# EAGLE schematic bt-shield-schmitt (EAGLE 6.1)
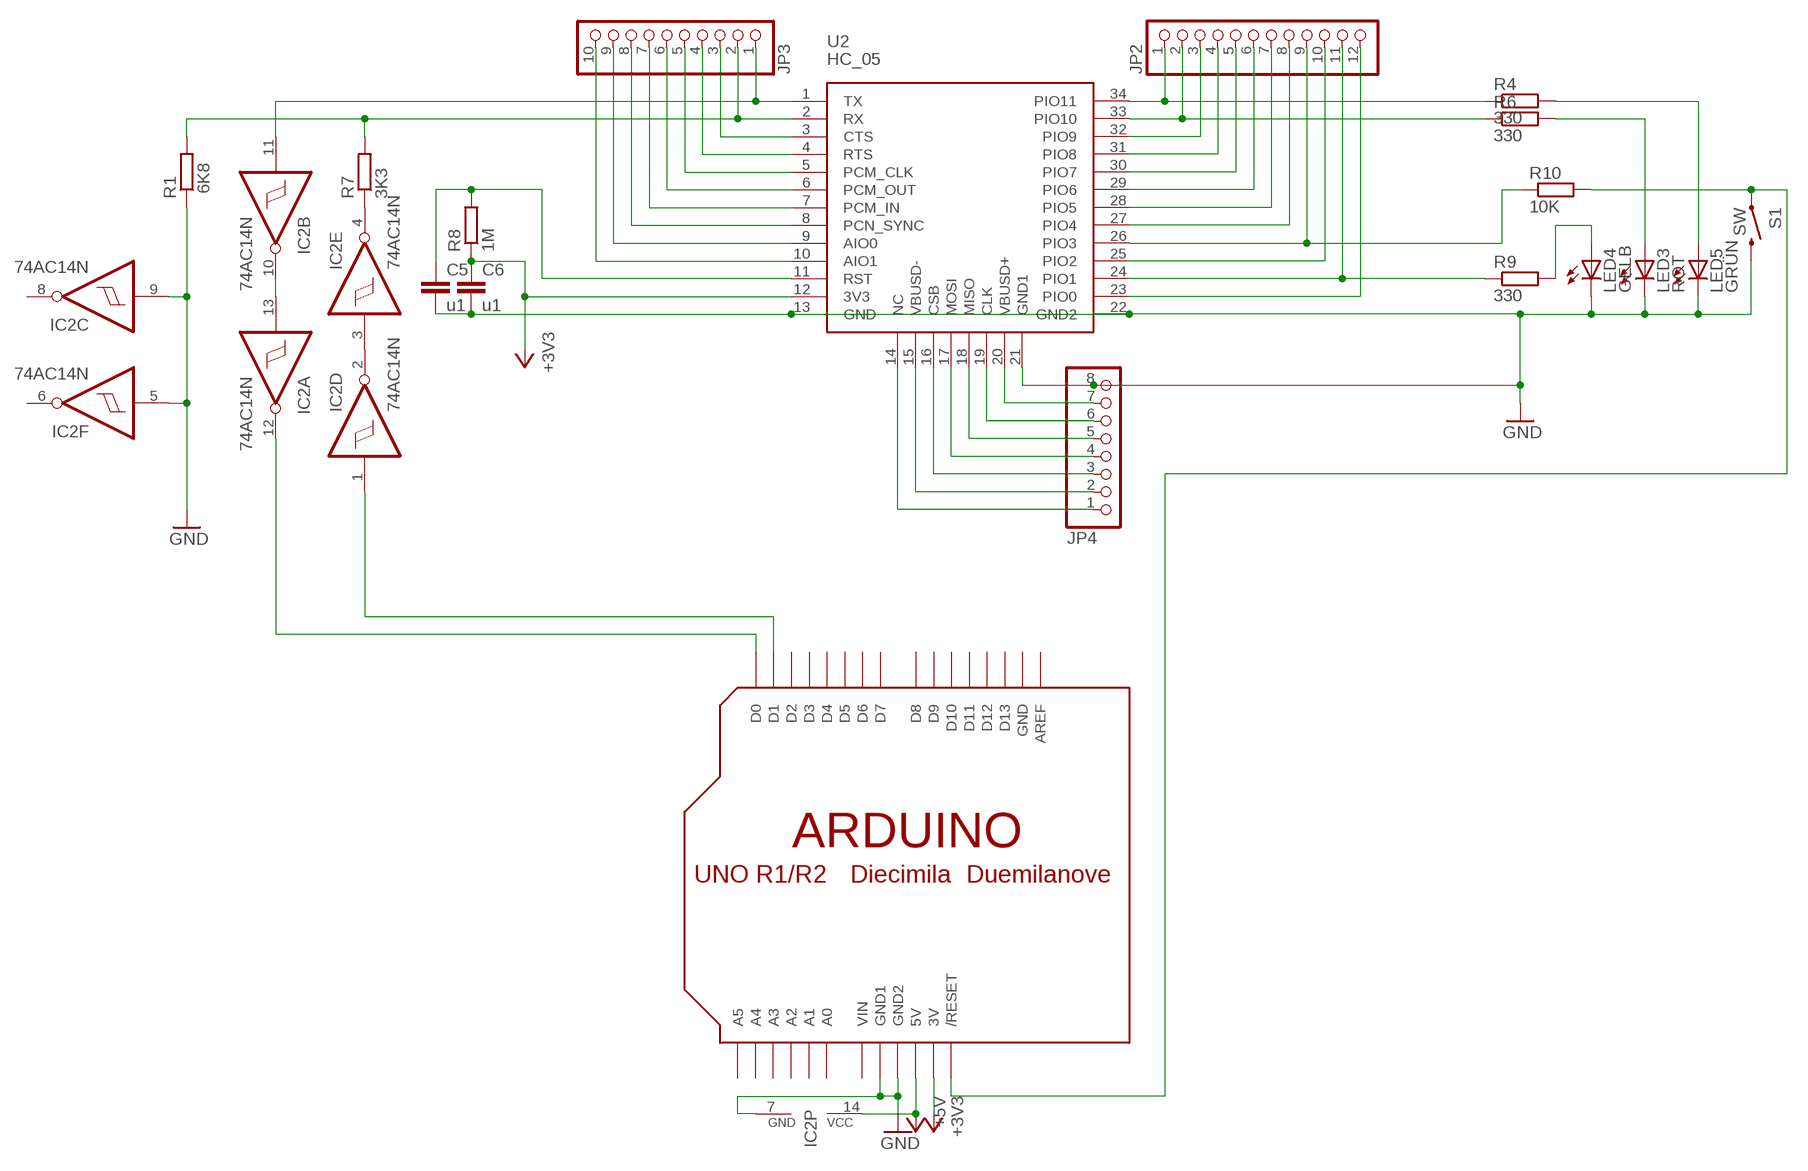
[diagram p0: schematic, sheet 1]

## Parts
C5  u1  C-EU025-025X050  [C025-025X050]
C6  u1  C-EU025-025X050  [C025-025X050]
IC2  74AC14N  [DIL14]
JP2  PINHD-1X12  [1X12]
JP3  PINHD-1X10  [1X10]
JP4  PINHD-1X8  [1X08]
LED3  ROT  LED5MM  [LED5MM]
LED4  GELB  LED5MM  [LED5MM]
LED5  GRÜN  LED5MM  [LED5MM]
R1  6K8  R-EU_0204/7  [0204/7]
R4  330  R-EU_0207/2V  [0207/2V]
R6  330  R-EU_0207/2V  [0207/2V]
R7  3K3  R-EU_0204/7  [0204/7]
R8  1M  R-EU_0207/2V  [0207/2V]
R9  330  R-EU_0207/2V  [0207/2V]
R10  10K  R-EU_0207/10  [0207/10]
S1  SW  SWITCH-MOMENTARY-2PTH  [TACTILE-PTH]
U2  HC_05  [BLUETOOTH_SMD]
U$1  ARDUINO-NOHOLE  [ARDUINO-NOHOLE]

## Nets
+3V3: C6.1 R8.1 U2.12(3V3) U$1.3V
+5V: IC2.14(P:VCC) U$1.5V
GND: C5.2 C6.2 IC2.5(F:I) IC2.7(P:GND) IC2.9(C:I) JP4.8 LED3.K(C) LED4.K(C) LED5.K(C) R1.1 S1.3 U2.13(GND) U2.21(GND1) U2.22(GND2) U$1.GND1 U$1.GND2
N$1: IC2.12(A:O) U$1.D0
N$2: R10.2 S1.1 U$1.RESET(/RESET)
N$3: JP3.3 U2.3(CTS)
N$4: C5.1 R8.2 U2.11(RST)
N$5: JP2.2 R6.1 U2.33(PIO10)
N$7: JP2.1 R4.1 U2.34(PIO11)
N$8: LED3.A R6.2
N$9: LED5.A R4.2
N$10: LED4.A R9.2
N$11: JP2.11 R9.1 U2.24(PIO1)
N$12: JP2.9 R10.1 U2.26(PIO3)
N$13: JP3.4 U2.4(RTS)
N$14: IC2.10(B:O) IC2.13(A:I)
N$15: JP3.5 U2.5(PCM_CLK)
N$16: IC2.11(B:I) JP3.1 U2.1(TX)
N$17: IC2.4(E:O) R7.1
N$18: IC2.2(D:O) IC2.3(E:I)
N$19: IC2.1(D:I) U$1.D1
N$20: JP3.2 R1.2 R7.2 U2.2(RX)
N$21: JP3.6 U2.6(PCM_OUT)
N$22: JP3.7 U2.7(PCM_IN)
N$23: JP3.8 U2.8(PCN_SYNC)
N$24: JP3.9 U2.9(AIO0)
N$25: JP3.10 U2.10(AIO1)
N$26: JP2.3 U2.32(PIO9)
N$27: JP2.4 U2.31(PIO8)
N$28: JP2.5 U2.30(PIO7)
N$29: JP2.6 U2.29(PIO6)
N$30: JP2.7 U2.28(PIO5)
N$31: JP2.8 U2.27(PIO4)
N$32: JP2.10 U2.25(PIO2)
N$33: JP2.12 U2.23(PIO0)
N$34: JP4.7 U2.20(VBUSD+)
N$35: JP4.6 U2.19(CLK)
N$36: JP4.5 U2.18(MISO)
N$38: JP4.3 U2.16(CSB)
N$39: JP4.2 U2.15(VBUSD-)
N$40: JP4.1 U2.14(NC)
N$41: JP4.4 U2.17(MOSI)
Unconnected: IC2.6(F:O) IC2.8(C:O) U$1.A0 U$1.A1 U$1.A2 U$1.A3 U$1.A4 U$1.A5 U$1.AREF U$1.D2 U$1.D3 U$1.D4 U$1.D5 U$1.D6 U$1.D7 U$1.D8 U$1.D9 U$1.D10 U$1.D11 U$1.D12 U$1.D13

## Power pins joined to a net without a drawn wire
GND: U$1.GND
VIN: U$1.VIN

## Library data of the parts
C5 C6 = rcl:C-EU: CAPACITOR, European symbol
IC2 = 74xx-eu:74*14: Hex schmitt trigger INVERTER
JP2 = pinhead:PINHD-1X12: PIN HEADER
JP3 = pinhead:PINHD-1X10: PIN HEADER
JP4 = pinhead:PINHD-1X8: PIN HEADER
LED3-LED5 = led:LED: LED OSRAM: - CHIPLED LG R971, LG N971, LY N971, LG Q971, LY Q971, LO R971, LY R971 LH N974, LH R974 LS Q976, LO Q976, LY Q976 LO Q996 - Hyper CHIPLED LW Q18S LB Q993, LB Q99A, LB R99A - SideLED LS A670, LO A670, LY A670, LG A670, LP A670 LB A673, LV A673, LT A673, LW A673 LH A674 LY A675 LS A676, LA A676, LO A676, LY A676, LW A676 LS A679, LY A679, LG A679 - Hyper Micro SIDELED® LS Y876, LA Y876, LO Y876, LY Y876 LT Y87S - SmartLED LW L88C, LW L88S LB L89C, LB L89S, LG L890 LS L89K, LO L89K, LY L89K LS L896, LA L896, LO L896, LY L896 - TOPLED LS T670, LO T670, LY T670, LG T670, LP T670 LSG T670, LSP T670, LSY T670, LOP T670, LYG T670 LG T671, LOG T671, LSG T671 LB T673, LV T673, LT T673, LW T673 LH T674 LS T676, LA T676, LO T676, LY T676, LB T676, LH T676, LSB T676, LW T676 LB T67C, LV T67C, LT T67C, LS T67K, LO T67K, LY T67K, LW E67C LS E67B, LA E67B, LO E67B, LY E67B, LB E67C, LV E67C, LT E67C LW T67C LS T679, LY T679, LG T679 LS T770, LO T770, LY T770, LG T770, LP T770 LB T773, LV T773, LT T773, LW T773 LH T774 LS E675, LA E675, LY E675, LS T675 LS T776, LA T776, LO T776, LY T776, LB T776 LHGB T686 LT T68C, LB T68C - Hyper Mini TOPLED® LB M676 - Mini TOPLED Santana® LG M470 LS M47K, LO M47K, LY M47K Source: http://www.osram.convergy.de LUXEON: - LUMILED® LXK2-PW12-R00, LXK2-PW12-S00, LXK2-PW14-U00, LXK2-PW14-V00 LXK2-PM12-R00, LXK2-PM12-S00, LXK2-PM14-U00 LXK2-PE12-Q00, LXK2-PE12-R00, LXK2-PE12-S00, LXK2-PE14-T00, LXK2-PE14-U00 LXK2-PB12-K00, LXK2-PB12-L00, LXK2-PB12-M00, LXK2-PB14-N00, LXK2-PB14-P00, LXK2-PB14-Q00 LXK2-PR12-L00, LXK2-PR12-M00, LXK2-PR14-Q00, LXK2-PR14-R00 LXK2-PD12-Q00, LXK2-PD12-R00, LXK2-PD12-S00 LXK2-PH12-R00, LXK2-PH12-S00 LXK2-PL12-P00, LXK2-PL12-Q00, LXK2-PL12-R00 Source: www.luxeon.com KINGBRIGHT: KA-3528ASYC Source: www.kingbright.com
R1 R4 R6-R10 = rcl:R-EU_: RESISTOR, European symbol
S1 = SparkFun:SWITCH-MOMENTARY-2
U2 = SerialPortBluetooth:HC_05
U$1 = adafruit:ARDUINO: Arduino Diecimila/Duemilanove Make a shield with ease, this package has all the named pins as well as the two mounting drill holes and an outline of the USB and DC power connector. The outline is on the DIMENSION layer, so if your board house uses it they will cut the outline to match. http://www.ladyada.net/library/pcb/eaglelibrary.html